# Altium schematic sheet BOTHUTINHIEU.SchDoc
size A; SheetNumber: 1; SheetTotal: 1
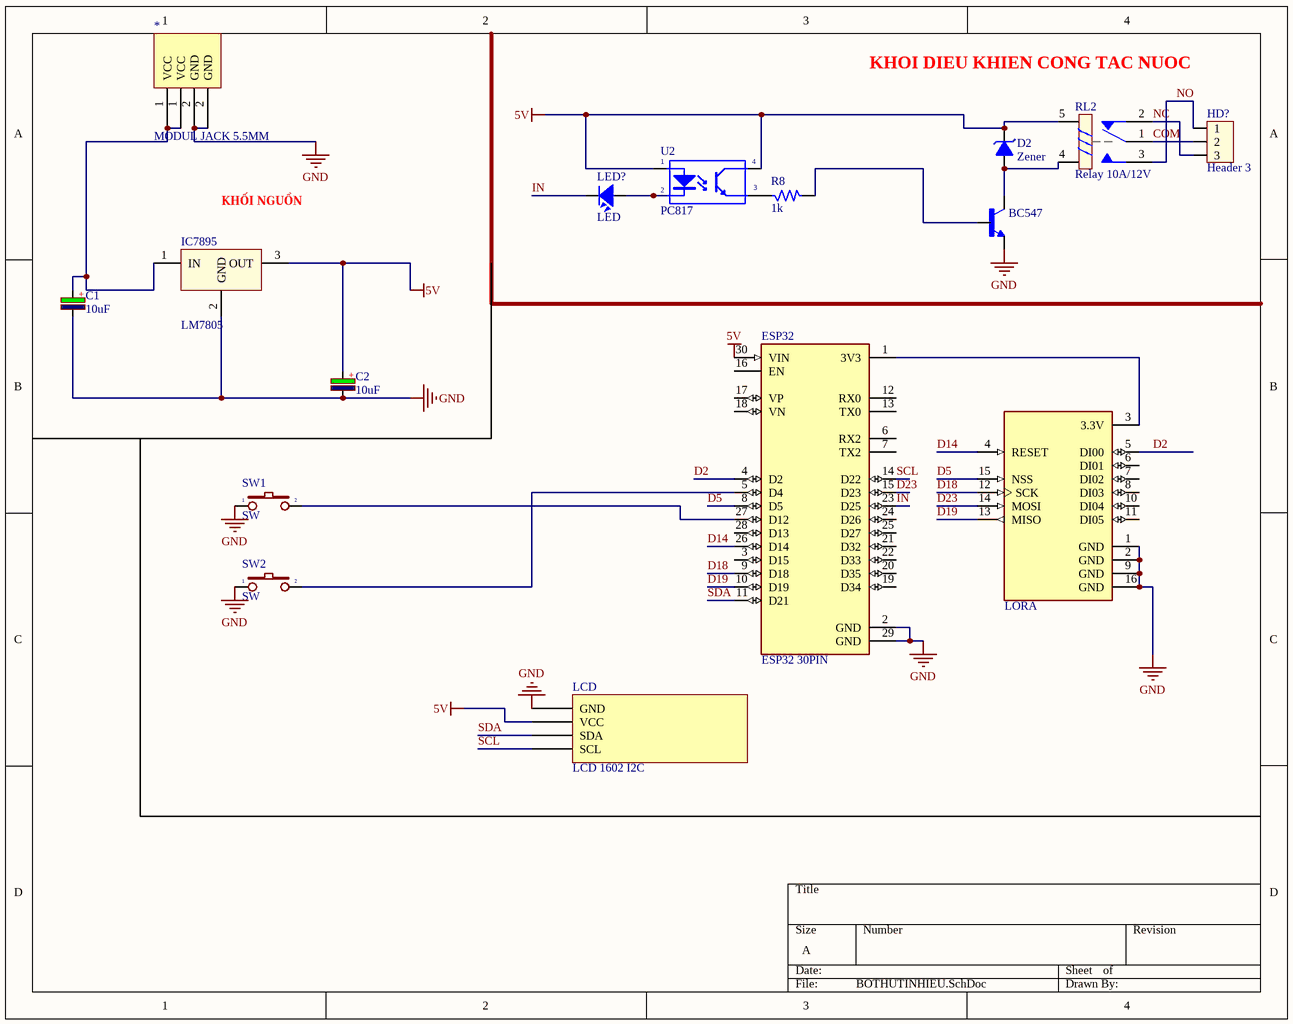
[diagram p0: BOTHUTINHIEU.SchDoc]

## Parts
*  MODUL JACK 5.5MM  [MODUL JACK 5.5MM]
BC547  BC547A  [BC547A]  (value not drawn)
C1  10uF  [CP1/2]
C2  10uF  [CP1/2]
D2  Zener  [D1A]
ESP32  ESP32 30PIN  [ESP32 30P]
HD?  Header 3  [HED3]
IC7895  LM7805  [QTO-220]
LCD  LCD 1602 I2C  [LCD1602]
LED?  LED  [LED-3]
LORA  LORA  [LORA RA-02]
R8  1k  [R1/4W]
RL2  Relay 10A/12V  [RL_SPDT_10A]
SW1  SW  [SW2]
SW2  SW  [SW2]
U2  PC817  [DIP4/W0.3]

## Nets
5V: C2.1 D2.2(K) ESP32.30(VIN) IC7895.3(OUT) LCD.2(VCC) RL2.5 U2.1(A) U2.4(C)
GND: *.2(GND) BC547.3(E) C1.2 C2.2 ESP32.2(GND) ESP32.29(GND) IC7895.2(GND) LCD.1(GND) LORA.1(GND) LORA.2(GND) LORA.9(GND) LORA.16(GND) SW1.1 SW2.1
COM: HD?.2 RL2.1
D2: ESP32.4(D2) LORA.5(DI00)
D5: ESP32.8(D5) LORA.15(NSS)
D14: ESP32.26(D14) LORA.4(RESET)
D18: ESP32.9(D18) LORA.12(SCK)
D19: ESP32.10(D19) LORA.13(MISO)
D23: ESP32.15(D23) LORA.14(MOSI)
IN: ESP32.23(D25) LED?.2
NC: HD?.3 RL2.2
NO: HD?.1 RL2.3
SCL: ESP32.14(D22) LCD.4(SCL)
SDA: ESP32.11(D21) LCD.3(SDA)
Net*_1: *.1(VCC) C1.1 IC7895.1(IN)
NetBC547_1: BC547.1(C) D2.1(A) RL2.4
NetBC547_2: BC547.2(B) R8.2
NetESP32_1: ESP32.1(3V3) LORA.3(3.3V)
NetESP32_5: ESP32.5(D4) SW2.2
NetESP32_27: ESP32.27(D12) SW1.2
NetLED?_1: LED?.1 U2.2(K)
NetR8_1: R8.1 U2.3(E)

Not connected (* = marked no-connect by the designer): ESP32 3(D15) 6(RX2) 7(TX2) 12(RX0) 13(TX0) 16(EN) 17(VP) 18(VN) 19(D34) 20(D35) 21(D32) 22(D33) 24(D26) 25(D27) 28(D13); LORA 6(DI01) 7(DI02) 8(DI03) 10(DI04) 11(DI05)

## Notes on the sheet
- KHOI DIEU KHIEN CONG TAC NUOC
- KHỐI NGUỒN
- (in symbol CP0) +

## Library data of the parts
C1 C2 = CP0: Cap P  0,1uF < 22uF , 16 - 50V; Value: 10uF/50V; Description 1: 10 => 220uF/6,3V/10V - 10uF => 100uF/16V; Description 2: 0,1uF => 33uF/50V - 10uF => 22uF/63V; Description 3: 0,47uF => 10uF/100V
D2 = Zener: DIOT ZENER
ESP32 = ESP32 30PIN: 30 PIN OUT MODULE
HD? = Hed3: Header 3 (Green); Value: Header 3
IC7895 = LM78xx: On ap +, from + 5 to + 24VDC; Value: LM7805
LED? = LED: LED Single colour Green and Red; Value: LED 3 ly Single Colour
R8 = R: Resistor 1/4W; Value: R1/4W - 1K
RL2 = Relay 1: Relay SPDT,10A - 12VDC 5 Pin; Value: Relay SPDT, 10A, 12V
SW1 SW2 = SW2: Switch button 2 pin; Value: SW chip 2 pin
U2 = PC817: Single Opto; Value: PC817